# Altium schematic sheet EndEffector- Connectors.SchDoc
size A4
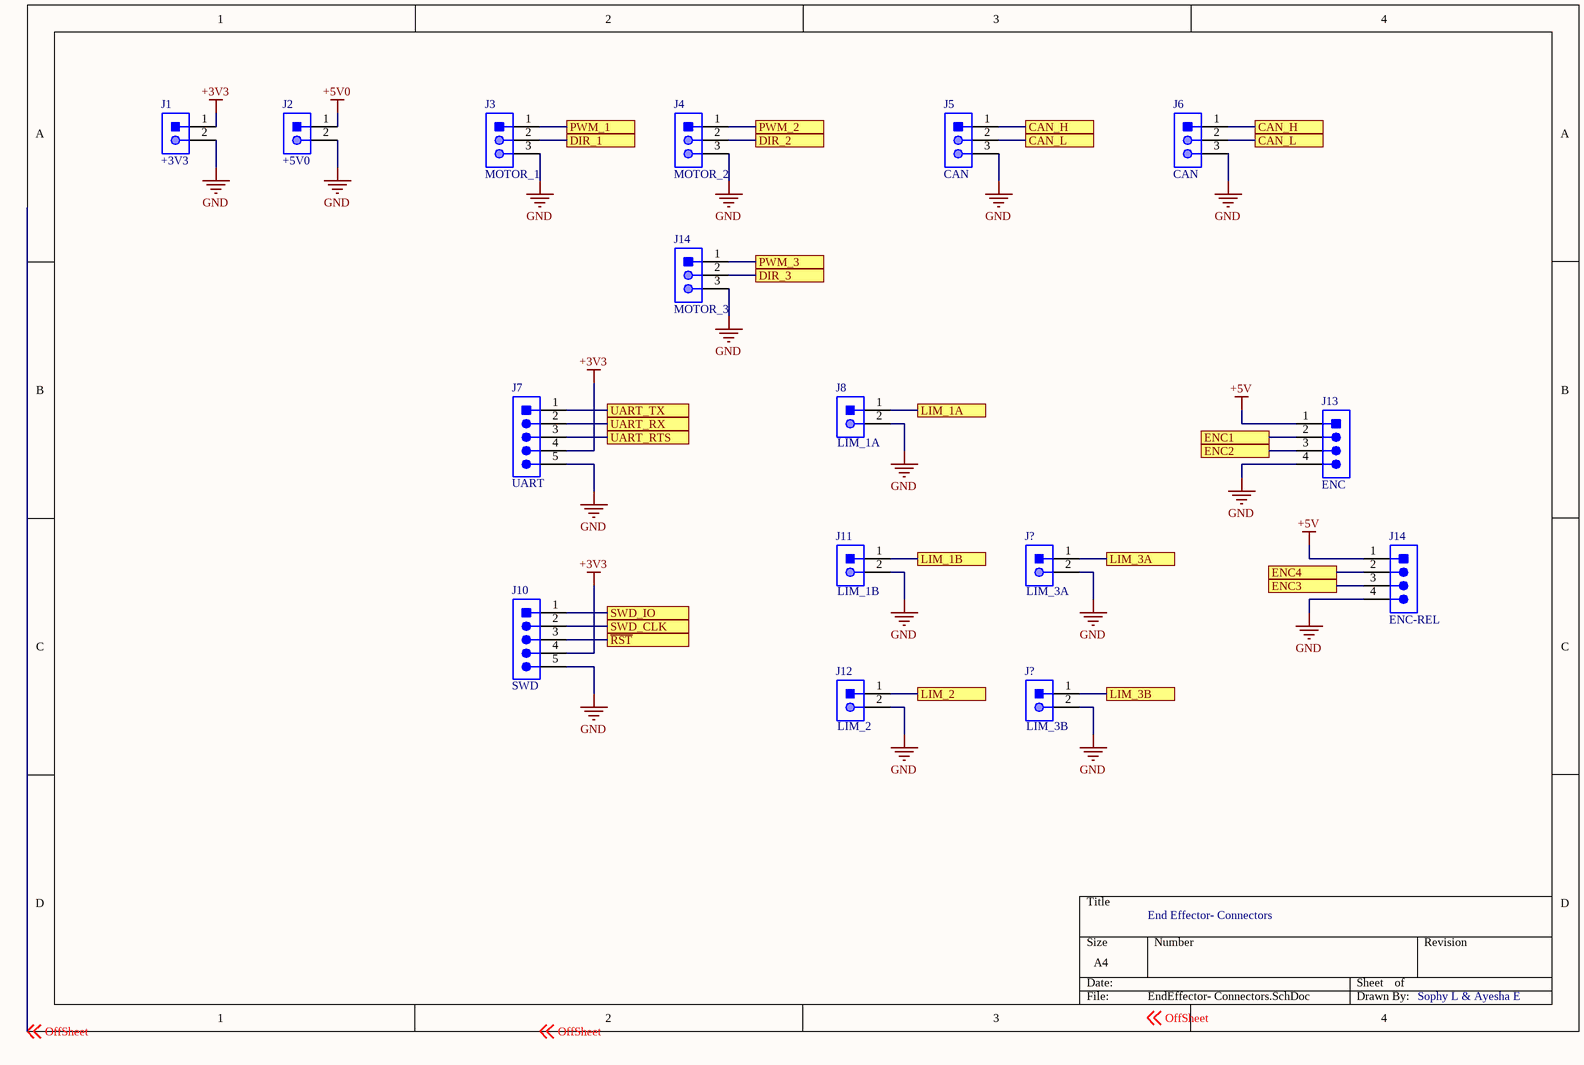
[diagram p0: EndEffector- Connectors.SchDoc]

## Parts
(Parts that share a designator on the sheet are numbered #1, #2 ... from top to bottom, then left to right.)
J1  +3V3
J2  +5V0
J3  MOTOR_1
J4  MOTOR_2
J5  CAN
J6  CAN
J7  UART
J8  LIM_1A
J10  SWD
J11  LIM_1B
J12  LIM_2
J13  ENC
J14#1  MOTOR_3
J14#2  ENC-REL
J?#1  LIM_3A
J?#2  LIM_3B

## Ports
CAN_H, CAN_L, DIR_1, DIR_2, DIR_3, ENC1, ENC2, ENC3, ENC4, LIM_1A, LIM_1B, LIM_2, LIM_3A, LIM_3B, PWM_1, PWM_2, PWM_3, SWD_CLK, SWD_IO, UART_RTS, UART_RX, UART_TX, ~{RST}

## Nets
+3V3: J1.1 J7.4 J10.4
+5V: J13.1 J14#2.1
+5V0: J2.1
GND: J1.2 J2.2 J3.3 J4.3 J5.3 J6.3 J7.5 J8.2 J10.5 J11.2 J12.2 J13.4 J14#1.3 J14#2.4 J?#1.2 J?#2.2
~{RST}: J10.3 ; port ~{RST}
CAN_H: J5.1 J6.1 ; port CAN_H
CAN_L: J5.2 J6.2 ; port CAN_L
DIR_1: J3.2 ; port DIR_1
DIR_2: J4.2 ; port DIR_2
DIR_3: J14#1.2 ; port DIR_3
ENC1: J13.2 ; port ENC1
ENC2: J13.3 ; port ENC2
ENC3: J14#2.3 ; port ENC3
ENC4: J14#2.2 ; port ENC4
LIM_1A: J8.1 ; port LIM_1A
LIM_1B: J11.1 ; port LIM_1B
LIM_2: J12.1 ; port LIM_2
LIM_3A: J?#1.1 ; port LIM_3A
LIM_3B: J?#2.1 ; port LIM_3B
PWM_1: J3.1 ; port PWM_1
PWM_2: J4.1 ; port PWM_2
PWM_3: J14#1.1 ; port PWM_3
SWD_CLK: J10.2 ; port SWD_CLK
SWD_IO: J10.1 ; port SWD_IO
UART_RTS: J7.3 ; port UART_RTS
UART_RX: J7.2 ; port UART_RX
UART_TX: J7.1 ; port UART_TX

## Notes on the sheet
- End Effector- Connectors
- Sophy L & Ayesha E
- Labels drawn without touching a wire or pin: OffSheet

## Library data of the parts
J1 J2 J8 J11 J12 J?#1 J?#2 = CON_2M_PH_SIDE_SMT: CONN HEADER PH SIDE 2POS 2MM SMD; Manufacturer: JST; Part Number: S2B-PH-SM4-TB; ComponentLink1Description: Datasheet; ComponentLink1URL: http://www.jst-mfg.com/product/pdf/eng/ePH.pdf
J3-J6 J14#1 = CON_3M_PH_SIDE_SMT: CONN HEADER PH SIDE 3POS 2MM SMD; Manufacturer: JST; Part Number: B3B-PH-SM4-TB; ComponentLink1Description: Datasheet; ComponentLink1URL: http://www.jst-mfg.com/product/pdf/eng/ePH.pdf
J7 J10 = CON_5M_PH_SIDE_TH: CONN HEADER PH SIDE 5POS 2MM; Manufacturer: JST; Part Number: S5B-PH-K-S; ComponentLink1Description: Datasheet; ComponentLink1URL: http://www.jst-mfg.com/product/pdf/eng/ePH.pdf
J13 J14#2 = CON_4M_PH_SIDE_SMT: CONN HEADER PH SIDE 4POS 2MM SMD; Manufacturer: JST; Part Number: B4B-PH-SM4-TB; ComponentLink1Description: Datasheet; ComponentLink1URL: http://www.jst-mfg.com/product/pdf/eng/ePH.pdf